# EAGLE design osmc_strip_x1 (EAGLE 5.06)
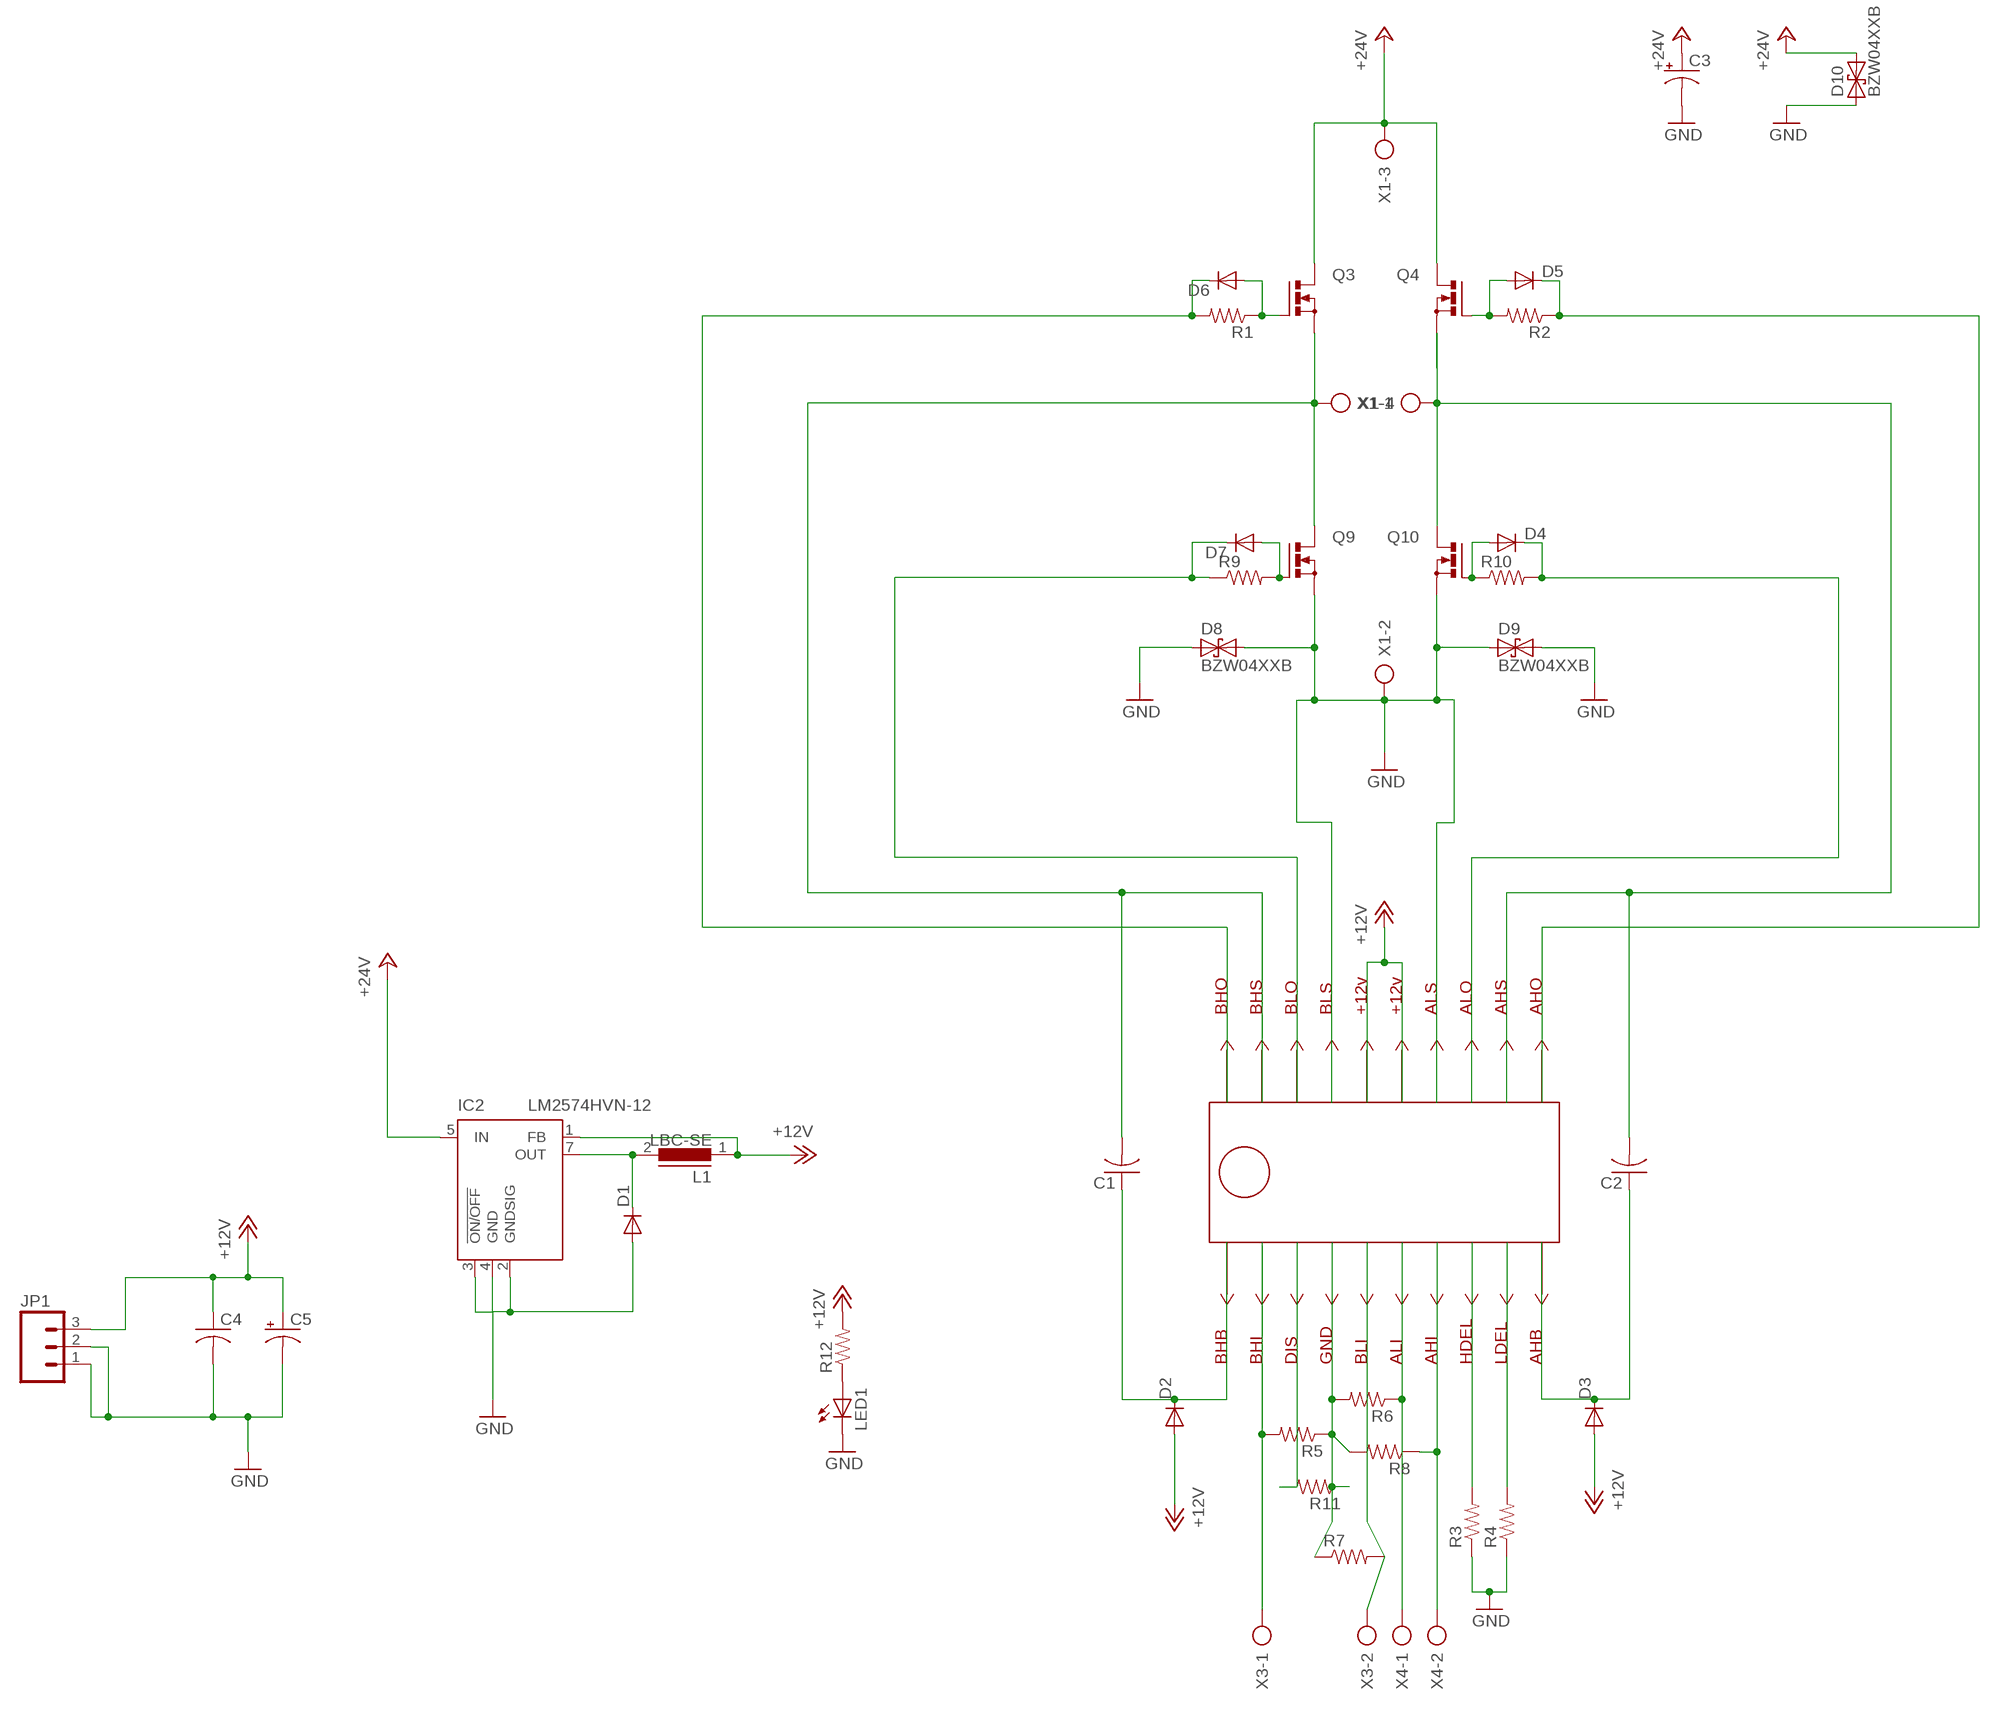
[diagram p0: schematic, sheet 1]

## Parts
C1  C-US075-032X103  [C075-032X103]
C2  C-US075-032X103  [C075-032X103]
C3  CPOL-USE5-13  [E5-13]
C4  C-US025-025X050  [C025-025X050]
C5  CPOL-USE5-8.5  [E5-8,5]
D1  DIODEPTH  [DIODE-1N4001]
D2  DIODEPTH  [DIODE-1N4001]
D3  DIODEPTH  [DIODE-1N4001]
D4  DIODE1N4148  [DIODE-1N4148]
D5  DIODE1N4148  [DIODE-1N4148]
D6  DIODE1N4148  [DIODE-1N4148]
D7  DIODE1N4148  [DIODE-1N4148]
D8  BZW04XXB  [F126Z12]
D9  BZW04XXB  [F126Z12]
D10  BZW04XXB  [F126Z12]
IC1  HIP4081  [HIP4081]
IC2  LM2574HVN-12  [DIL08]
JP1  M03PTH  [1X03]
L1  LBC-SE  [LBC-SE]
LED1  LED3MM  [LED3MM]
Q3  PMOSFET_NTO220BV  [TO220BV]
Q4  PMOSFET_NTO220BV  [TO220BV]
Q9  PMOSFET_NTO220BV  [TO220BV]
Q10  PMOSFET_NTO220BV  [TO220BV]
R1  RESISTORPTH1  [AXIAL-0.3]
R2  RESISTORPTH1  [AXIAL-0.3]
R3  RESISTORPTH-1/6W  [1/6W-RES]
R4  RESISTORPTH-1/6W  [1/6W-RES]
R5  RESISTORPTH-1/6W  [1/6W-RES]
R6  RESISTORPTH-1/6W  [1/6W-RES]
R7  RESISTORPTH-1/6W  [1/6W-RES]
R8  RESISTORPTH-1/6W  [1/6W-RES]
R9  RESISTORPTH1  [AXIAL-0.3]
R10  RESISTORPTH1  [AXIAL-0.3]
R11  RESISTORPTH-1/6W  [1/6W-RES]
R12  RESISTORPTH-1/6W  [1/6W-RES]
X1  AK500/4  [AK500/4]
X3  AK500/2  [AK500/2]
X4  AK500/2  [AK500/2]

## Nets
+12V: C4.1 C5.+ D2.A D3.A IC1.15(VCC) IC1.16(+12V) IC2.1(FB) JP1.3 L1.1 R12.2
+24V: C3.+ D10.C IC2.5(IN) Q3.D Q4.D X1.3
GND: C3.- C4.2 C5.- D1.A D8.A D8.C D9.A D9.C D10.A IC1.4(GND) IC1.14(ALS) IC1.17(BLS) IC2.2(GNDSIG) IC2.3(!ON/OFF) IC2.4(GND) JP1.1 JP1.2 LED1.K(C) Q9.S Q10.S R3.1 R4.1 R5.1 R6.2 R7.1 R8.2 R11.1 X1.2
N$1: C1.2 IC1.19(BHS) Q3.S Q9.D X1.4
N$2: C2.2 IC1.12(AHS) Q4.S Q10.D X1.1
N$3: D5.C IC1.11(AHO) R2.P$1
N$4: C1.1 D2.C IC1.1(BHB)
N$5: IC1.2(BHI) R5.2 X3.1
N$6: D5.A Q4.G R2.P$2
N$7: IC1.3(DIS) R11.2
N$8: D4.A Q10.G R10.P$1
N$9: IC1.7(AHI) R8.1 X4.2
N$10: IC1.5(BLI) R7.2 X3.2
N$11: IC1.6(ALI) R6.1 X4.1
N$12: D7.A Q9.G R9.P$2
N$14: C2.1 D3.C IC1.10(AHB)
N$15: D1.C IC2.7(OUT) L1.2
N$16: IC1.8(HDEL) R3.2
N$17: LED1.A R12.1
N$19: D6.A Q3.G R1.P$1
N$20: D6.C IC1.20(BHO) R1.P$2
N$21: IC1.9(LDEL) R4.2
N$22: D7.C IC1.18(BLO) R9.P$1
N$23: D4.C IC1.13(ALO) R10.P$2

## Library data of the parts
C1 C2 C4 = rcl:C-US: CAPACITOR, American symbol
C3 = resistor:CPOL-US: POLARIZED CAPACITOR, American symbol
C5 = rcl:CPOL-US: POLARIZED CAPACITOR, American symbol
D1-D7 = SparkFun:DIODE: Diode These are standard reverse protection diodes and small signal diodes. SMA package can handle up to about 1A. SOD-323 can handle about 200mA. What the SOD-323 package when ordering, there are some mfgs out there that are 5-pin packages.
D8-D10 = diode:BZW04XXB: DIODE uni and bidirectional supressor diode
IC1 = A-JD3:HIP4081
IC2 = linear:LM2574?-*: SIMPLE SWITCHER 0.5A Step-Down Voltage Regulator Source: http://cache.national.com/ds/LM/LM2574.pdf
JP1 = SparkFun:M03: Header 3 Standard 3-pin 0.1" header. Use with straight break away headers (SKU : PRT-00116), right angle break away headers (PRT-00553), swiss pins (PRT-00743), machine pins (PRT-00117), and female headers (PRT-00115). Molex polarized connector foot print use with SKU : PRT-08232 with associated crimp pins and housings.
L1 = inductors:LBC-SE: INDUCTOR
LED1 = SparkFun:LED: LEDs Standard schematic elements and footprints for 5mm, 3mm, 1206, and 0603 sized LEDs. 5mm - Spark Fun Electronics SKU : COM-00529 (and others)
Q3 Q4 Q9 Q10 = transistor-power:PMOSFET_N: Power MOSFET N-Channel
R1-R12 = SparkFun:RESISTOR: Resistor Basic schematic elements and footprints for 0603, 1206, and PTH 1/10th watt (small) resistors.
X1 = con-ptr500:AK500/4: CONNECTOR
X3 X4 = con-ptr500:AK500/2: CONNECTOR

## Board
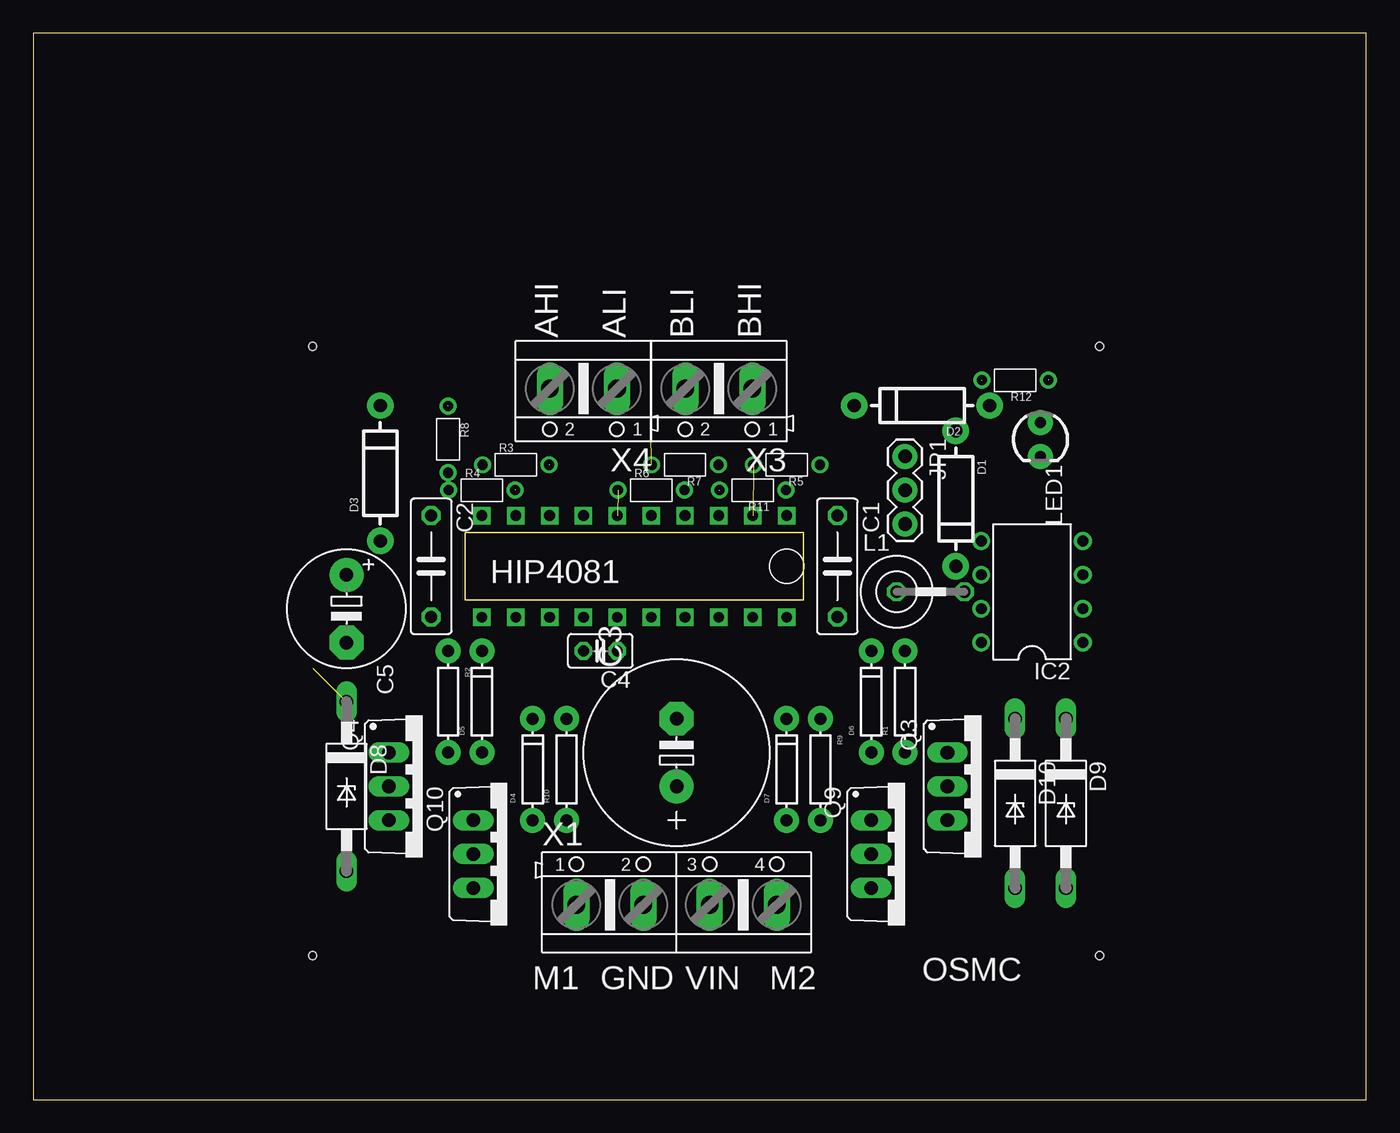
[diagram p1: board, top side]
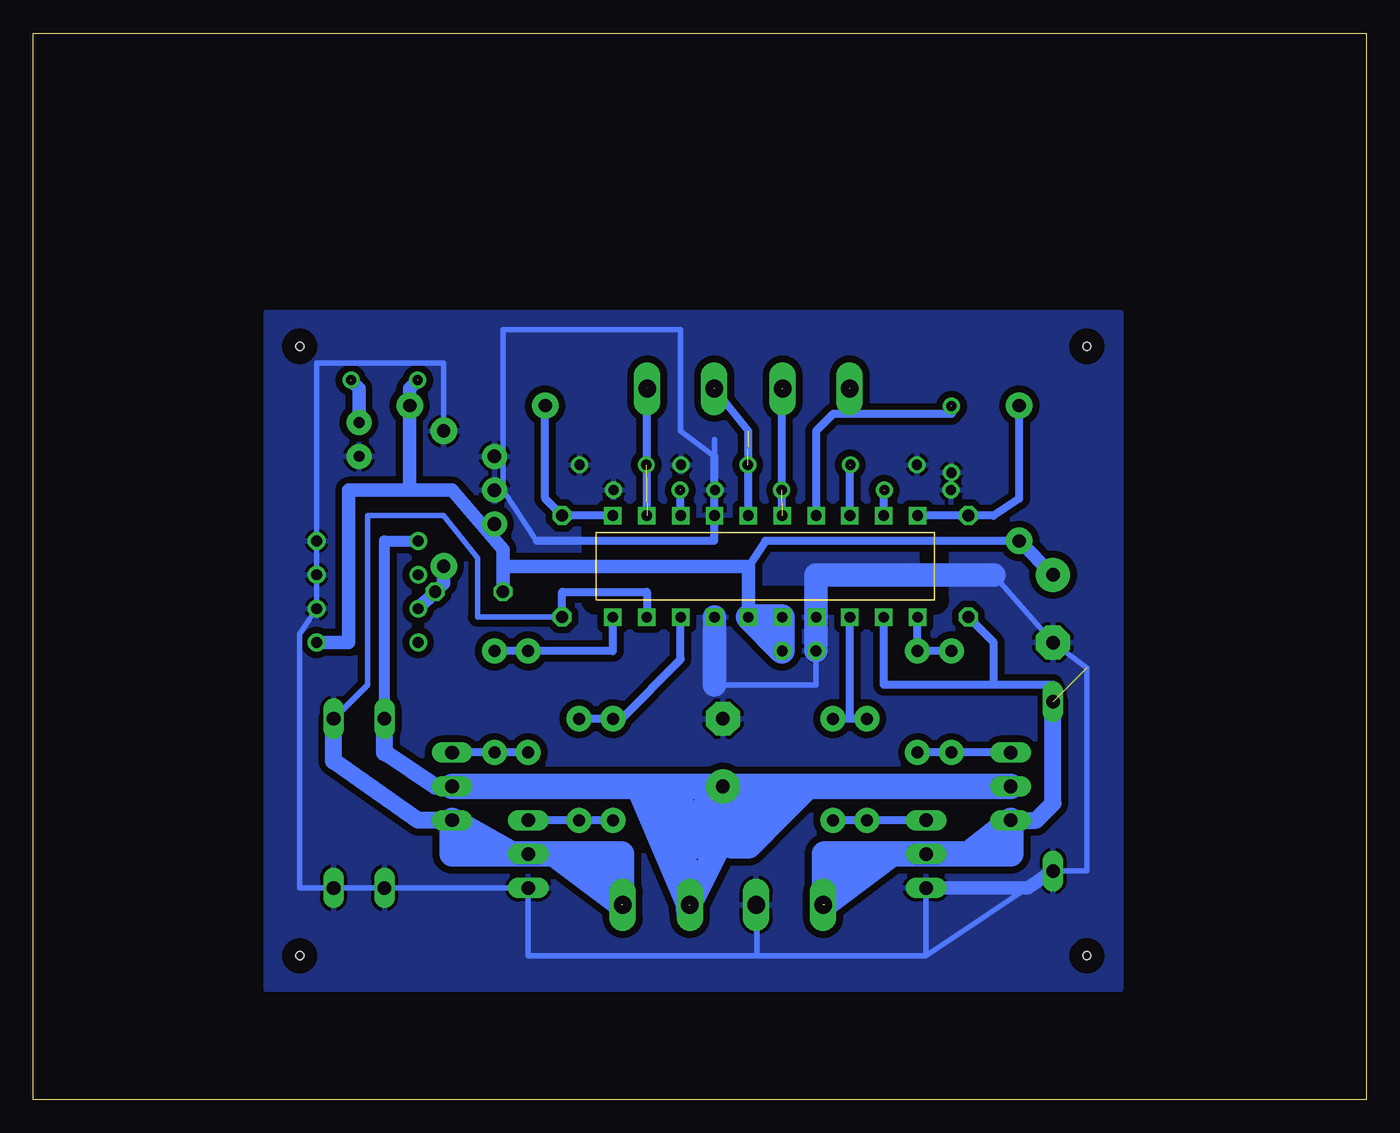
[diagram p2: board, bottom side, seen from below]

Size 100 x 80 mm. Coordinates in mm from the lower left corner, seen from the top.
Outline: 0,0 100,0 100,80 0,80 0,0
Copper layers (1*16): Top 0.035mm / dielectric 1.5mm / Bottom 0.035mm
Design rules "default *": minimum track width 10mil, minimum drill 24mil, track to track 20mil, track to pad 20mil, pad to pad 8mil, via to via 8mil, smd to smd 8mil, copper to edge 40mil, drill to drill 8mil, minimum pad ring 10mil, minimum via ring 8mil, stop-mask expansion 4mil, vias tented up to drill 0mil, thermal gap 10mil
Holes 0.6 mm at 80.01,10.79 20.95,10.79 20.95,56.52 80.01,56.52

### Footprints (pad centres in the part's own frame; a part is rotated, then mirrored left to right if it is on the bottom)
C075-032X103 = drill 0.914 octagon: 1 -3.81,0; 2 3.81,0
E5-13 = drill 1.016 pad 2.54 round: + -2.54,0 | drill 1.016 pad 2.54 octagon: - 2.54,0
C025-025X050 = drill 0.813 octagon: 1 -1.27,0; 2 1.27,0
E5-8,5 = drill 1.016 pad 2.54 round: + -2.54,0 | drill 1.016 pad 2.54 octagon: - 2.54,0
DIODE-1N4001 = drill 1 pad 1.981 round: A -5.08,0; C 5.08,0
DIODE-1N4148 = drill 0.9 pad 1.88 round: A -3.81,0; C 3.81,0
F126Z12 = drill 1.016 long: A 6.35,0; C -6.35,0
HIP4081 = drill 0.8 square: 1 -11.43,-3.81; 2 -8.89,-3.81; 3 -6.35,-3.81; 4 -3.81,-3.81; 5 -1.27,-3.81; 6 1.27,-3.81; 7 3.81,-3.81; 8 6.35,-3.81; 9 8.89,-3.81; 10 11.43,-3.81; 11 11.43,3.81; 12 8.89,3.81; 13 6.35,3.81; 14 3.81,3.81; 15 1.27,3.81; 16 -1.27,3.81; 17 -3.81,3.81; 18 -6.35,3.81; 19 -8.89,3.81; 20 -11.43,3.81
DIL08 = drill 0.813 pad 1.27 round: 1 -3.81,-3.81; 2 -1.27,-3.81; 3 1.27,-3.81; 4 3.81,-3.81; 5 3.81,3.81; 6 1.27,3.81; 7 -1.27,3.81; 8 -3.81,3.81
1X03 = drill 1.016 pad 1.88 round: 1 0,0; 2 2.54,0; 3 5.08,0
LBC-SE = drill 0.914 octagon: 1 -2.54,0; 2 2.54,0
LED3MM = drill 0.813 pad 1.88 round: A -1.27,0; K 1.27,0
TO220BV = drill 1.016 long: D 0,-2.54; G -2.54,-2.54; S 2.54,-2.54
AXIAL-0.3 = drill 0.9 pad 1.88 round: P$1 -3.81,0; P$2 3.81,0
1/6W-RES = drill 0.762 round: 1 -2.5,0; 2 2.5,0
AK500/4 = drill 1.321 long: 1 -7.518,0; 2 -2.489,0; 3 2.489,0; 4 7.518,0
AK500/2 = drill 1.321 long: 1 -2.515,0; 2 2.515,0

### Placement (x,y rotation side)
C1  60.33,40.01 270 top
C2  29.84,40.01 270 top
C3  48.26,26.04 90 top
C4  42.55,33.66 180 top
C5  23.5,36.83 270 top
D1  69.22,45.09 270 top
D2  66.67,52.07 180 top
D3  26.04,46.99 90 top
D4  37.47,24.77 90 top
D5  33.66,29.84 90 top
D6  62.87,29.84 90 top
D7  56.52,24.77 90 top
D8  23.5,23.5 270 top
D9  77.47,22.23 270 top
D10  73.66,22.23 270 top
IC1  45.09,40.01 180 top
IC2  74.93,38.1 90 top
JP1  65.41,48.26 270 top
L1  67.31,38.1 0 top
LED1  75.56,49.53 270 top
Q3  71.12,23.5 270 top
Q4  29.21,23.5 270 top
Q9  65.41,18.41 270 top
Q10  35.56,18.41 270 top
R1  65.41,29.84 90 top
R2  31.11,29.84 270 top
R3  36.2,47.62 0 top
R4  33.66,45.72 0 top
R5  56.52,47.62 180 top
R6  46.35,45.72 0 top
R7  48.9,47.62 180 top
R8  31.11,49.53 270 top
R9  59.05,24.77 270 top
R10  40.01,24.77 90 top
R11  53.98,45.72 180 top
R12  73.66,53.98 180 top
X1  48.26,14.61 0 top
X3  51.44,53.34 180 top
X4  41.27,53.34 180 top

### Tracks (layer width: path | path; a pad name or v marks a point on that pad's centre or on a via)
+12V  (1 unrouted)
  Bottom 0.61: 46.35,40.01 45.09,41.91 D3.A
  Bottom 0.813: JP1.3 65.41,41.91 64.77,41.27 L1.1
  Bottom 1.016: IC1.16 46.35,40.01 64.77,40.01 | 71.75,45.72 76.33,45.72 76.33,34.29 IC2.1 | 64.77,40.01 64.77,41.27 68.58,45.72 71.75,45.72 | 71.75,45.72 D2.A 71.75,53.34 71.12,53.98 | 64.77,40.01 L1.1 | C5.+ D3.A
  Bottom 1.93: C4.1 IC1.15 IC1.16 C4.1
+24V  (1 unrouted)
  Bottom 0.813: IC2.5 73.66,41.91 D10.C
  Bottom 1.27: Q3.D 69.85,23.5 73.66,26.04 D10.C
  Bottom 1.778: 47.62,23.5 C3.+
  Bottom 1.93: 51.44,23.5 51.44,20.95 | 51.44,20.95 50.8,13.97 | 48.9,23.5 47.62,23.5 46.99,23.5 | 48.9,23.5 51.44,23.5 | Q4.D 41.91,23.5 | 41.91,23.5 46.35,23.5 | 53.98,23.5 51.44,23.5 | 54.61,23.5 Q3.D | 46.35,23.5 50.8,14.61 54.61,23.5 | 46.35,23.5 46.99,23.5 | 46.99,23.5 50.16,19.05 50.16,20.95 48.9,23.5 | 54.61,23.5 53.98,23.5 | 53.98,23.5 51.44,19.05 51.44,20.95 | 46.35,19.05 47.62,19.05 46.35,22.23 43.18,22.23 | 43.18,22.23 42.55,22.86 41.91,23.5 | 43.81,21.59 46.35,19.05 | 46.35,19.05 46.35,19.68 43.81,21.59 | 43.18,22.23 43.81,21.59
GND  (1 unrouted)
  Bottom 0.406: 45.72,10.79 62.87,10.79 Q9.S 80.01,15.88 80.01,34.92 IC2.2 IC2.3 IC2.4 78.74,55.24 69.22,55.24 D1.A | 45.72,10.79 45.72,15.88 | 33.02,10.79 45.72,10.79 | 33.02,10.79 Q10.S | C4.2 41.27,31.11 48.9,31.11 | 27.94,39.37 C5.- 20.95,32.38 20.95,17.14 D8.A 33.02,10.79 | 48.9,49.53 48.9,48.26 51.44,50.16 51.44,57.78 64.77,57.78 64.77,45.72 62.23,41.91
  Bottom 0.61: 62.23,41.91 48.9,41.91 IC1.4 48.9,48.26
  Bottom 1.016: D8.A 25.4,15.88 Q10.S
  Bottom 1.778: C4.2 IC1.14 41.27,39.37 27.94,39.37 | 48.9,31.11 IC1.17
  pour Bottom: 82.55,59.05 82.55,8.26 18.41,8.26 18.41,59.05
N$1  (1 unrouted)
  Bottom 0.406: 77.47,28.57 74.93,31.11 74.93,43.81 69.22,43.81 66.67,40.64 66.67,36.2 C1.2
  Bottom 0.61: C1.2 60.33,38.1 53.98,38.1 IC1.19
  Bottom 1.27: Q3.S 71.12,20.95 77.47,25.4 77.47,28.57
  Bottom 1.93: Q9.D 64.14,18.41 Q3.S 68.58,18.41 66.67,18.41 | Q9.D 60.96,18.41 55.88,14.61 | 65.41,18.41 66.67,18.41 | 66.67,18.41 67.94,19.05 65.41,18.41 | Q9.D 65.41,18.41 | Q9.D 55.88,18.41 55.88,14.61 | 55.88,14.61 57.15,17.14 59.05,17.14
N$2  (1 unrouted)
  Bottom 0.406: 29.84,31.11 27.94,31.11 | 23.5,29.84 23.5,31.11
  Bottom 0.61: 27.94,31.11 27.94,34.29 C2.2 | IC1.12 36.2,31.11 29.84,31.11 23.5,31.11
  Bottom 1.27: 23.5,29.84 23.5,22.23 24.77,20.95 Q4.S
  Bottom 1.93: 35.56,18.41 38.1,16.51 | 38.1,16.51 40.64,14.61 | Q10.D 33.66,18.41 35.56,18.41 | 28.57,18.41 26.67,18.41 26.67,19.68 | 28.57,18.41 29.84,18.41 | 29.84,18.41 Q10.D | 29.84,18.41 Q4.S 26.67,19.68 | 26.67,19.68 28.57,18.41 | 29.84,18.41 Q10.D | 35.56,18.41 40.64,18.41 40.64,15.24 38.73,17.78 38.1,17.78 38.1,16.51 | 38.1,16.51 40.01,17.14
N$3
  Bottom 0.61: IC1.11 D5.C R2.P$1
N$4
  Bottom 0.61: IC1.1 C1.1 61.59,45.09 D2.C
N$5  (2 unrouted)
  Bottom 0.61: IC1.2 53.98,53.34
N$6
  Bottom 0.61: Q4.G R2.P$2 D5.A
N$7  (1 unrouted)
  Bottom 0.61: IC1.3 51.44,45.72
N$8
  Bottom 0.61: R10.P$1 D4.A Q10.G
N$9  (2 unrouted)
  Bottom 0.61: 38.73,51.44 31.11,51.44 31.11,52.07 | 38.73,51.44 38.73,53.34 | 38.73,51.44 40.01,51.44 41.27,50.16 IC1.7
N$10  (2 unrouted)
  Bottom 0.61: IC1.5 46.35,50.16 48.9,53.34
N$11  (2 unrouted)
  Bottom 0.61: IC1.6 43.81,53.34
N$12
  Bottom 0.61: Q9.G R9.P$2 D7.A
N$14
  Bottom 0.406: IC1.10 C2.1
  Bottom 0.61: IC1.10 27.94,43.81 26.04,45.09 D3.C
N$15
  Bottom 1.016: D1.C 69.22,38.73 L1.2 IC2.7
N$16  (1 unrouted)
  Bottom 0.61: IC1.8 38.73,47.62
N$17  (1 unrouted)
  Bottom 1.016: 76.2,53.98 75.56,53.34 LED1.A
N$19
  Bottom 0.61: D6.A R1.P$1 Q3.G
N$20
  Bottom 0.61: IC1.20 56.52,33.66 D6.C R1.P$2
N$21  (1 unrouted)
  Bottom 0.61: IC1.9 36.2,45.72
N$22
  Bottom 0.61: R9.P$1 D7.C 55.88,28.57 51.44,33.02 IC1.18
N$23
  Bottom 0.61: D4.C 38.73,28.57 | 38.73,28.57 R10.P$2 | 38.73,28.57 IC1.13

### Text on the board
tPlace: AHI | ALI | BLI | BHI | HIP4081 | OSMC | M1 | GND | VIN | M2
dxf: OSMC_JD